# Altium project SmartCoin.PrjPcb
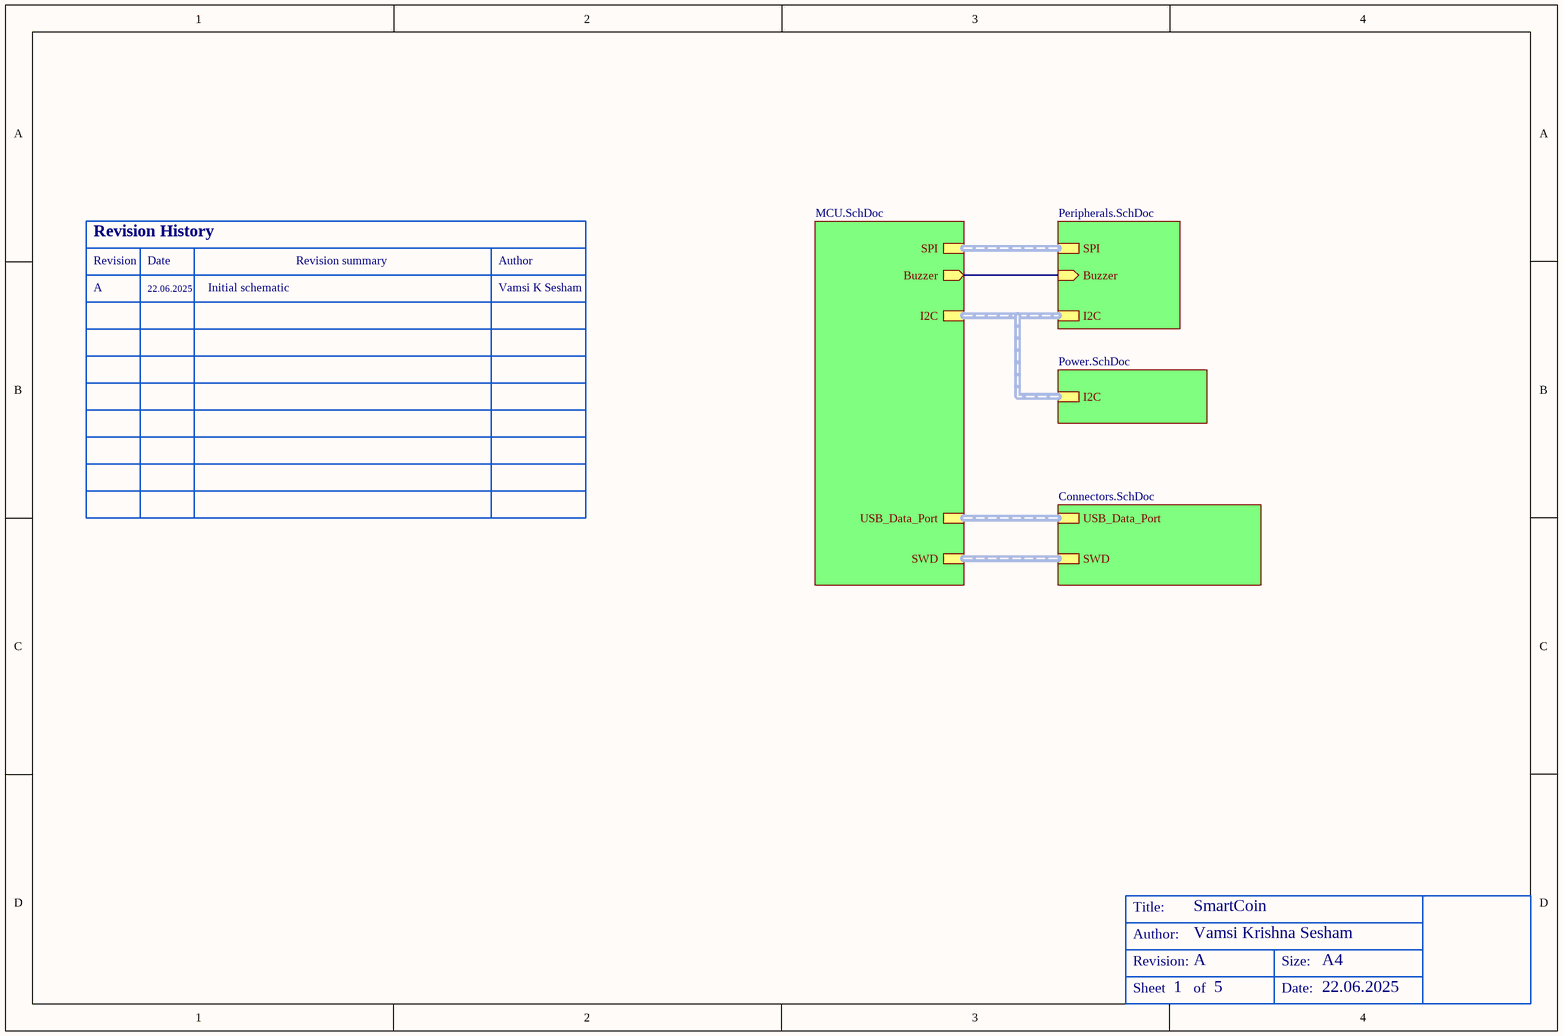
[diagram p0: SmartCoin.SchDoc]
5 sheets, 44 parts. Net scope: hierarchical (ports join the sheet entries above them; power ports are global).
Board file: SmartCoin.PcbDoc
Sheets:
  SmartCoin.SchDoc
     = Peripherals.SchDoc
     = MCU.SchDoc
     = Connectors.SchDoc
     = Power.SchDoc

## Sheet SmartCoin.SchDoc: SmartCoin
size A4; Date: 22.06.2025; Author: Vamsi Krishna Sesham; Revision: A; SheetNumber: 1; SheetTotal: 5

### Parts
(Parts that share a designator on the sheet are numbered #1, #2 ... from top to bottom, then left to right.)
*#1  RevisionHistory  (value not drawn)  (graphical)
*#2  TitleBlock  (value not drawn)  (graphical)

### Sub-sheets
? = Peripherals.SchDoc: I2C (harness I2C), Buzzer (in), SPI (harness SPI_Flash)
? = MCU.SchDoc: USB_Data_Port (harness USB_Data), I2C (harness I2C), SWD (harness SWD Debug), Buzzer (out), SPI (harness SPI_Flash)
? = Connectors.SchDoc: USB_Data_Port (harness USB_Data), SWD (harness SWD Debug)
? = Power.SchDoc: I2C (harness I2C)

### Nets
BZR: sheet /Buzzer, sheet /Buzzer

### Notes on the sheet
- A
- 22.06.2025
- Initial schematic
- Vamsi K Sesham
- (in symbol RevisionHistory) Revision History; Revision; Date; Revision summary; Author
- (in symbol TitleBlock) Title:; Author:; Revision:; Size:; A4; Sheet; of; Date:

## Sheet Peripherals.SchDoc: SmartCoin
size A4; Date: 22.06.2025; Author: Vamsi Krishna Sesham; Revision: A; SheetNumber: 4; SheetTotal: 5
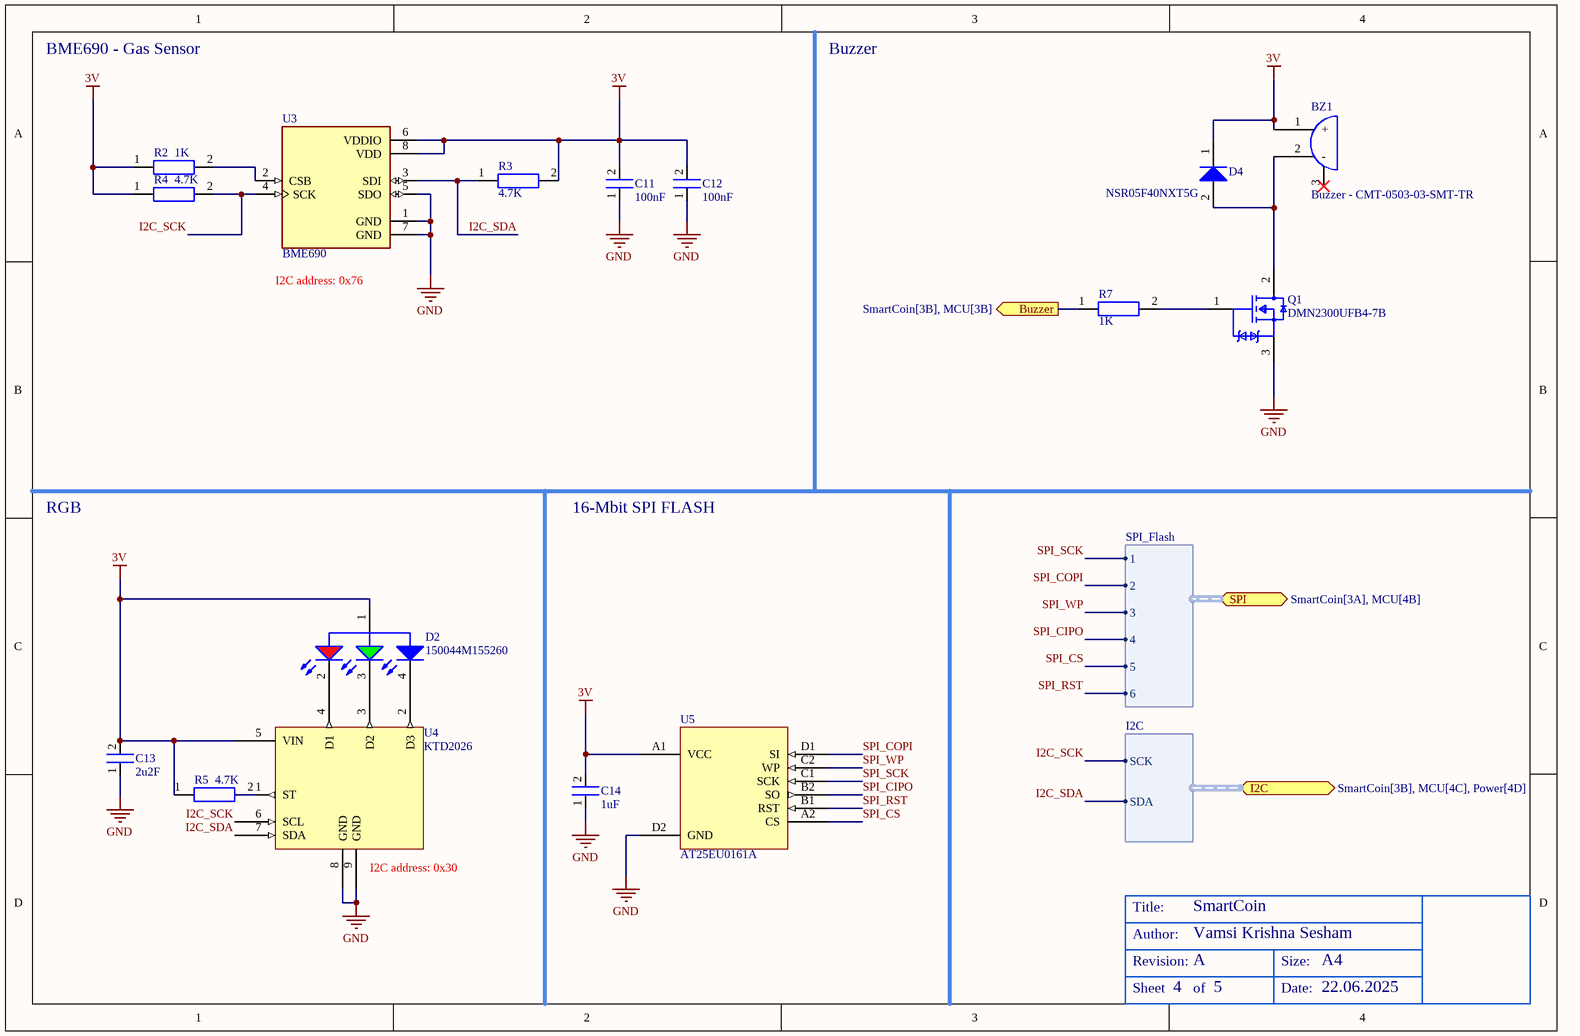
[diagram p1: Peripherals.SchDoc]

### Parts
(Parts that share a designator on the sheet are numbered #1, #2 ... from top to bottom, then left to right.)
*#3  TitleBlock  (value not drawn)  (graphical)
BZ1  Buzzer - CMT-0503-03-SMT-TR  [Buzzer - CMT-0503-03-SMT-TR]
C11  100nF  [Capacitor - 0201]
C12  100nF  [Capacitor - 0201]
C13  2u2F  [Capacitor - 0201]
C14  1uF  [Capacitor - 0201]
D2  150044M155260  [WL-SFCC_0404_150044M155260]
D4  NSR05F40NXT5G  [ONSC-DSN-2-152AC-01_V]
Q1  DMN2300UFB4-7B  [FP-X2-DFN1006-3-MFG]
R2  1K  [Resistor - 0201]
R3  4.7K  [Resistor - 0201]
R4  4.7K  [Resistor - 0201]
R5  4.7K  [Resistor - 0201]
R7  1K  [Resistor - 0201]
U3  BME690  [IC_BME688]
U4  KTD2026  [KTD2026]
U5  AT25EU0161A  [AT25EU0161A]

### Ports
Buzzer (out, see SmartCoin[3B], MCU[3B]), I2C (bidir, harness I2C, see SmartCoin[3B], MCU[4C], Power[4D]), SPI (bidir, harness SPI_Flash, see SmartCoin[3A], MCU[4B])

### Harnesses
I2C: SCK, SDA
SPI_Flash: 1, 2, 3, 4, 5, 6

### Nets
3V: BZ1.1(+) C11.2 C12.2 C13.2 C14.2 D2.1(A) D4.1(K) R2.1 R3.2 R4.1 R5.1 U3.6(VDDIO) U3.8(VDD) U4.5(VIN) U5.A1(VCC)
GND: C11.1 C12.1 C13.1 C14.1 Q1.3(S) U3.1(GND) U3.5(SDO) U3.7(GND) U4.8(GND) U4.9(GND) U5.D2(GND)
BZR: R7.1 ; port Buzzer
I2C_SCK: R4.2 U3.4(SCK) U4.6(SCL) ; port I2C.SCK
I2C_SDA: R3.1 U3.3(SDI) U4.7(SDA) ; port I2C.SDA
SPI_CIPO: U5.B2(SO) ; port SPI.4
SPI_COPI: U5.D1(SI) ; port SPI.2
SPI_CS: U5.A2(CS) ; port SPI.5
SPI_RST: U5.B1(RST) ; port SPI.6
SPI_SCK: U5.C1(SCK) ; port SPI.1
SPI_WP: U5.C2(WP) ; port SPI.3
NetBZ1_2: BZ1.2(-) D4.2(A) Q1.2(D)
NetD2_2: D2.2(K) U4.4(D1)
NetD2_3: D2.3(K) U4.3(D2)
NetD2_4: D2.4(K) U4.2(D3)
NetQ1_1: Q1.1(G) R7.2
NetR2_2: R2.2 U3.2(CSB)
NetR5_2: R5.2 U4.1(ST)

Not connected (* = marked no-connect by the designer): BZ1 3*

### Notes on the sheet
- BME690 - Gas Sensor
- Buzzer
- (near U3) I2C address: 0x76
- RGB
- 16-Mbit SPI FLASH
- (near U4) I2C address: 0x30
- (in symbol TitleBlock) Title:; Author:; Revision:; Size:; A4; Sheet; of; Date:

### Library data of the parts
BZ1 = Buzzer - CMT-0503-03-SMT-TR: MAGNETIC BUZZER TRANSDUCER
C11-C14 = Capacitor - 0201
D2 = CMP-03913-98750578-1: 150044M155260 WL-SFCC SMT Full-color Chip LED compact; Color: Blue, Green, Red; Power Dissipation: 24mW; Reverse Voltage: 5V; Dominant Wavelength: 530nm; Forward Voltage: 2V; Luminous Intensity: 50mcd; Forward Current: 30mA; Peak Wavelength: 465nm; Viewing Angle: 140°; NexarPartId: 98750578; Max Operating Temperature: 85°C; Width: 1mm; Case/Package: 0404; Min Operating Temperature: -40°C; Max Reverse Voltage (DC): 5V; RoHS: Compliant; Length: 1mm; Height: 650µm
D4 = CMP-1055-00232-1: Schottky Barrier Diode, 2-Pin DSN, Pb-Free, Tape and Reel; Manufacturer: On Semiconductor; IFSM Max (A): 10; Configuration: Single; RoHS: TRUE; PackageVersion: Rev. C, 01/2011; ComponentLink3Description: Package Specification; ComponentLink3URL: http://www.onsemi.cn/pub_link/Collateral/152AC.PDF; PackageDescription: 2-Pin Micro Molded Package, Body 1 x 0.6 mm; ComponentLink1URL: http://www.onsemi.com/; ComponentLink1Description: Manufacturer URL; Mounting Technology: Surface Mount; Packing: Tape and Reel; PackageReference: DSN-2-152AC-01; ComponentLink2Description: Datasheet; DatasheetVersion: Rev. 3; ComponentLink2URL: http://www.onsemi.cn/pub_link/Collateral/NSR05F40.PDF; PartNumber: NSR05F40NXT5G
Q1 = CMP-12801-000056-1: MOSFET N-CH 20V 1.3A 3DFN; Manufacturer: Diodes Inc.; Rthja Max: 250°C/W; Standoff Height: 0mm; Turn On Delay Time: 3.5ns; Depletion Mode: False; Number Of N Channels: 1; Max Junction Temp: +150°C; Threshold Vgs Max: 0.95V; Gate To Source Voltage: 8V; Input Capacitace At Vds: 67.6pF @ 20V; Power Dissipation: 500mW; Max Forward Diode Voltage: 1.2V; Pulse Drain Current: 6A; Gate Charge At Vgs: 1.6nC @ 4.5V; Threshold Vgs Min: 0.45V; Drain To Source Resistance: 175mΩ; Turn Off Delay Time: 38ns; Typ Forward Diode Voltage: 0.7V; Category: Trans; Lead Free: Yes; Octopart: https://octopart.com/dmn2300ufb4-7b-diodes+inc.-21789371; RoHS: TRUE; Drain To Source Breakdown Voltage: 20V; ComponentLink2Description: Datasheet; Drain To Source Voltage: 20V; ComponentLink2URL: https://www.diodes.com/assets/Datasheets/DMN2300UFB4.pdf; Automotive: No; Height: 0.4mm; Temperature Range High: +150°C; Package: X2-DFN1006-3; Mouser Description: MOSFET 20V N-Ch ENH Mode 175mOhm 4.5V 1.30A; Digikey Description: MOSFET N-CH 20V 1.3A 3DFN; Footprint Url: https://www.diodes.com/assets/Package-Files/X2-DFN1006-3.pdf; Device Class L1: Discrete Semiconductors; Temperature Range Low: -55°C; Number Of Channels: 1; Device Class L3: MOSFETs; Device Class L2: Transistors; Manufacturer Part Number: DMN2300UFB4-7B; Temperature: -55°C to +150°C; Continuous Drain Current: 1.3A
R2-R5 R7 = Resistor - 0201
U3 = CMP-008-000000-2: Gas sensor measuring relative humidity, barometric pressure, ambient temperature and gas (VOC); Pin Count: 8; Availability: Unavailable; Package: None; Price: None; MP: BME688; Source: BME688.SchLib; Design Item ID: BME688; Value: *; Component Type: Standard; ComponentLink1Description: New link; ComponentLink1URL: https://www.mouser.de/ProductDetail/Bosch-Sensortec/BME690?qs=%252BXxaIXUDbq38jwlEAGDF7A%3D%3D&mgh=1&vip=1&utm_id=20979042634&utm_source=google&utm_medium=cpc&utm_marketing_tactic=emeacorp&gad_source=1&gbraid=0AAAAADn_wf2GV-P32WQOtb6QF-9Q6urY0&gclid=CjwKCAjwn6LABhBSEiwAsNJrjqYGezIL6UTP-OEPoU9ondhUKEEh1LMLQiGljPd-_uXlPKwCiylmnRoC0IEQAvD_BwE
U4 = KTD2026: 3-CHANNEL Rgb Led Driver With I2C
U5 = AT25EU0161A: 16-Mbit, Ultra-Low Energy Serial Flash Memory

## Sheet MCU.SchDoc: SmartCoin
size A4; Date: 22.06.2025; Author: Vamsi Krishna Sesham; Revision: A; SheetNumber: 2; SheetTotal: 5
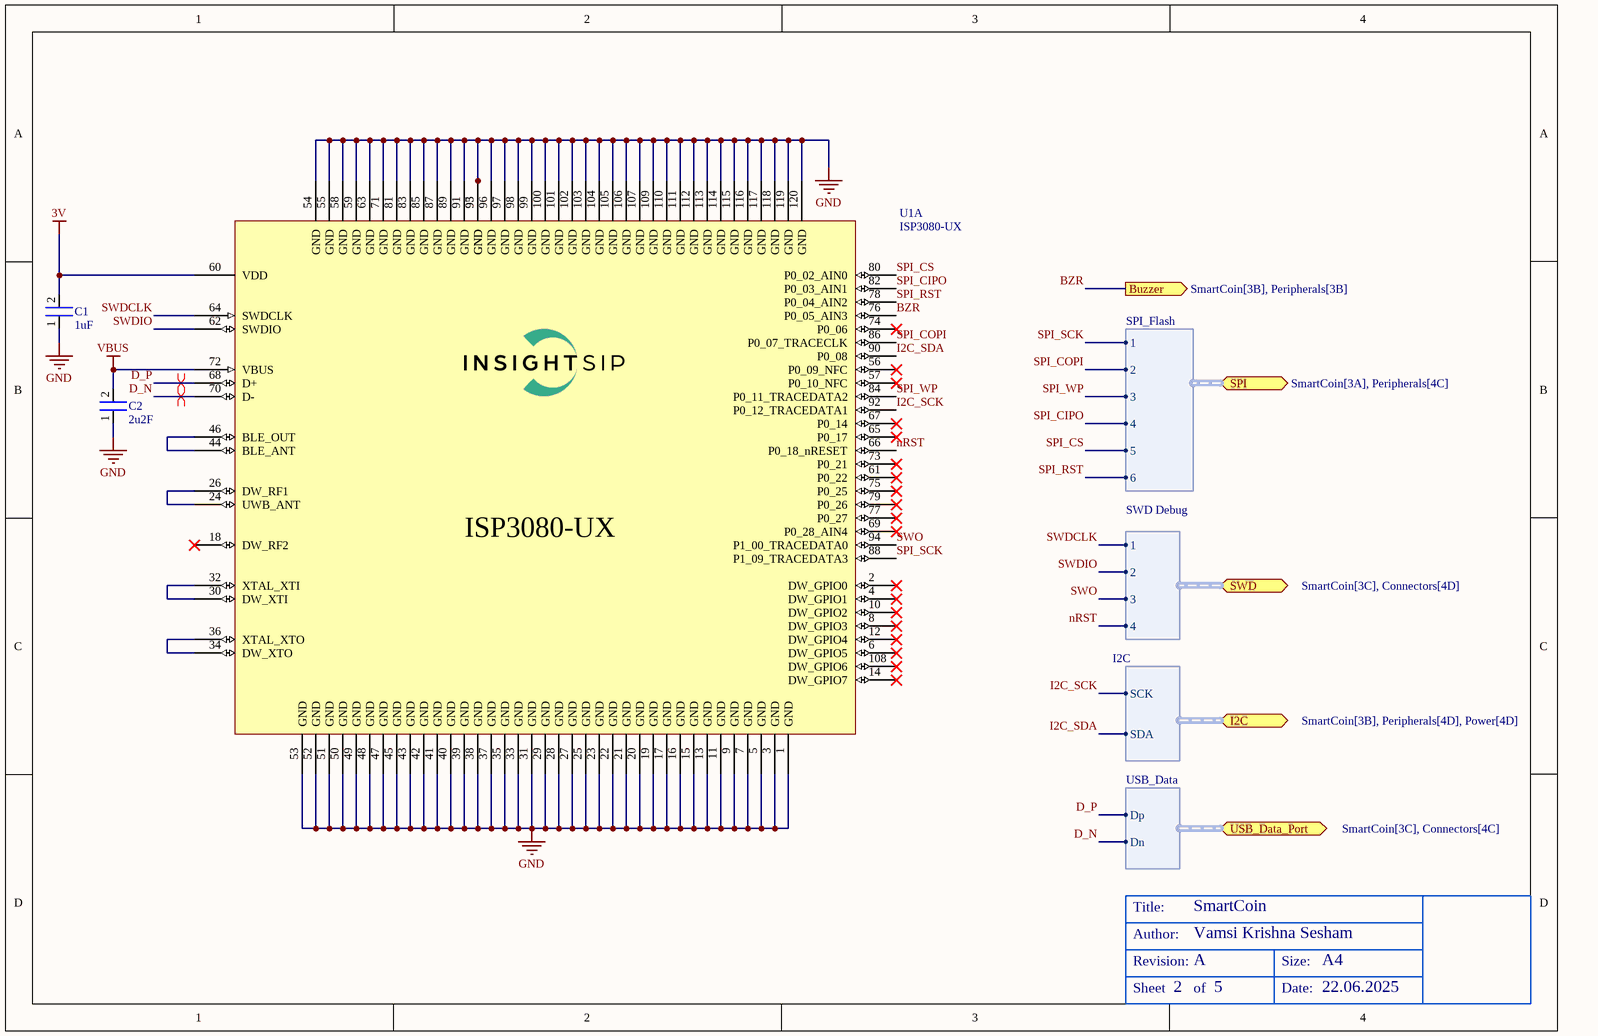
[diagram p2: MCU.SchDoc]

### Parts
(Parts that share a designator on the sheet are numbered #1, #2 ... from top to bottom, then left to right.)
*#4  TitleBlock  (value not drawn)  (graphical)
C1  1uF  [Capacitor - 0201]
C2  2u2F  [Capacitor - 0201]
U1  ISP3080-UX  [ISP3080-UX]  (part A of 2)

### Ports
Buzzer (out, see SmartCoin[3B], Peripherals[3B]), I2C (bidir, harness I2C, see SmartCoin[3B], Peripherals[4D], Power[4D]), SPI (bidir, harness SPI_Flash, see SmartCoin[3A], Peripherals[4C]), SWD (bidir, harness SWD Debug, see SmartCoin[3C], Connectors[4D]), USB_Data_Port (bidir, harness USB_Data, see SmartCoin[3C], Connectors[4C])

### Harnesses
USB_Data: Dp, Dn
I2C: SCK, SDA
SWD Debug: 1, 2, 3, 4
SPI_Flash: 1, 2, 3, 4, 5, 6

### Nets
3V: C1.2 U1.60(VDD)
GND: C1.1 C2.1 U1.1(GND) U1.3(GND) U1.5(GND) U1.7(GND) U1.9(GND) U1.11(GND) U1.13(GND) U1.15(GND) U1.16(GND) U1.17(GND) U1.19(GND) U1.20(GND) U1.21(GND) U1.22(GND) U1.23(GND) U1.25(GND) U1.27(GND) U1.28(GND) U1.29(GND) U1.31(GND) U1.33(GND) U1.35(GND) U1.37(GND) U1.38(GND) U1.39(GND) U1.40(GND) U1.41(GND) U1.42(GND) U1.43(GND) U1.45(GND) U1.47(GND) U1.48(GND) U1.49(GND) U1.50(GND) U1.51(GND) U1.52(GND) U1.53(GND) U1.54(GND) U1.55(GND) U1.58(GND) U1.59(GND) U1.63(GND) U1.71(GND) U1.81(GND) U1.83(GND) U1.85(GND) U1.87(GND) U1.89(GND) U1.91(GND) U1.93(GND) U1.95(GND) U1.96(GND) U1.97(GND) U1.98(GND) U1.99(GND) U1.100(GND) U1.101(GND) U1.102(GND) U1.103(GND) U1.104(GND) U1.105(GND) U1.106(GND) U1.107(GND) U1.109(GND) U1.110(GND) U1.111(GND) U1.112(GND) U1.113(GND) U1.114(GND) U1.115(GND) U1.116(GND) U1.117(GND) U1.118(GND) U1.119(GND) U1.120(GND)
VBUS: C2.2 U1.72(VBUS)
BZR: U1.76(P0_05_AIN3) ; port Buzzer
D_N: U1.70(D-) ; port USB_Data_Port.Dn
D_P: U1.68(D+) ; port USB_Data_Port.Dp
I2C_SCK: U1.92(P0_12_TRACEDATA1) ; port I2C.SCK
I2C_SDA: U1.90(P0_08) ; port I2C.SDA
nRST: U1.66(P0_18_nRESET) ; port SWD.4
SPI_CIPO: U1.82(P0_03_AIN1) ; port SPI.4
SPI_COPI: U1.86(P0_07_TRACECLK) ; port SPI.2
SPI_CS: U1.80(P0_02_AIN0) ; port SPI.5
SPI_RST: U1.78(P0_04_AIN2) ; port SPI.6
SPI_SCK: U1.88(P1_09_TRACEDATA3) ; port SPI.1
SPI_WP: U1.84(P0_11_TRACEDATA2) ; port SPI.3
SWDCLK: U1.64(SWDCLK) ; port SWD.1
SWDIO: U1.62(SWDIO) ; port SWD.2
SWO: U1.94(P1_00_TRACEDATA0) ; port SWD.3
NetU1_24: U1.24(UWB_ANT) U1.26(DW_RF1)
NetU1_30: U1.30(DW_XTI) U1.32(XTAL_XTI)
NetU1_34: U1.34(DW_XTO) U1.36(XTAL_XTO)
NetU1_44: U1.44(BLE_ANT) U1.46(BLE_OUT)

Not connected (* = marked no-connect by the designer): U1 2(DW_GPIO0)* 4(DW_GPIO1)* 6(DW_GPIO5)* 8(DW_GPIO3)* 10(DW_GPIO2)* 12(DW_GPIO4)* 14(DW_GPIO7)* 18(DW_RF2)* 56(P0_09_NFC)* 57(P0_10_NFC)* 61(P0_22)* 65(P0_17)* 67(P0_14)* 69(P0_28_AIN4)* 73(P0_21)* 74(P0_06)* 75(P0_25)* 77(P0_27)* 79(P0_26)* 108(DW_GPIO6)*

### Layout directives
differential pair: D_N, D_P

### Notes on the sheet
- (in symbol TitleBlock) Title:; Author:; Revision:; Size:; A4; Sheet; of; Date:

### Library data of the parts
C1 C2 = Capacitor - 0201
U1 = CMP-006-000000-2: BLE & UWB module (Revision C); Source: ISP3080C.SchLib; Design Item ID: ISP3080-UX

## Sheet Connectors.SchDoc: SmartCoin
size A4; Date: 22.06.2025; Author: Vamsi Krishna Sesham; Revision: A; SheetNumber: 3; SheetTotal: 5
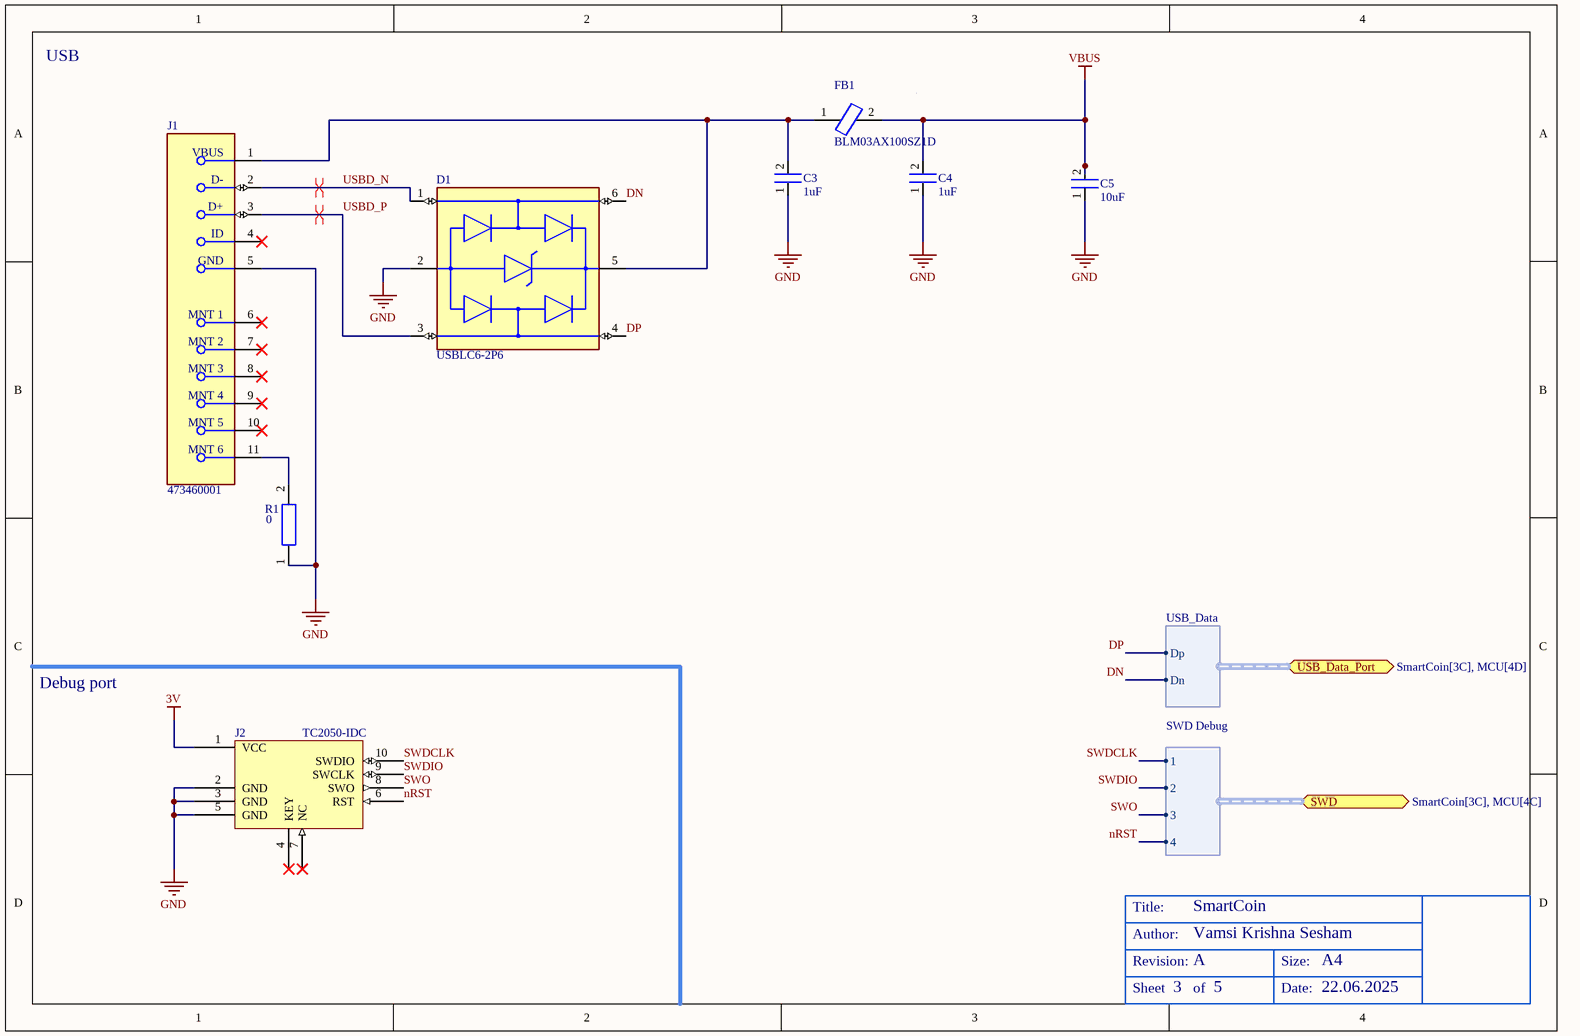
[diagram p3: Connectors.SchDoc]

### Parts
(Parts that share a designator on the sheet are numbered #1, #2 ... from top to bottom, then left to right.)
*#5  TitleBlock  (value not drawn)  (graphical)
C3  1uF  [Capacitor - 0201]
C4  1uF  [Capacitor - 0201]
C5  10uF  [Capacitor - 0402]
D1  USBLC6-2P6  [FP-SOT-666-MFG]
FB1  BLM03AX100SZ1D  [Ferrite Beat - 0201]
J1  473460001  [FP-473460001-MFG]
J2  TC2050-IDC  [TC2050-IDC]  (no BOM)
R1  0  [Resistor - 0402]

### Ports
SWD (bidir, harness SWD Debug, see SmartCoin[3C], MCU[4C]), USB_Data_Port (bidir, harness USB_Data, see SmartCoin[3C], MCU[4D])

### Harnesses
USB_Data: Dp, Dn
SWD Debug: 1, 2, 3, 4

### Nets
3V: J2.1(VCC)
GND: C3.1 C4.1 C5.1 D1.2(GND) J1.5(GND) J2.2(GND) J2.3(GND) J2.5(GND) R1.1
VBUS: C4.2 C5.2 FB1.2
DN: D1.6(I/O1) ; port USB_Data_Port.Dn  [project net D_N]
DP: D1.4(I/O2) ; port USB_Data_Port.Dp  [project net D_P]
nRST: J2.6(RST) ; port SWD.4
SWDCLK: J2.10(SWDIO) ; port SWD.1
SWDIO: J2.9(SWCLK) ; port SWD.2
SWO: J2.8(SWO) ; port SWD.3
USBD_N: D1.1(I/O1) J1.2(D-)
USBD_P: D1.3(I/O2) J1.3(D+)
NetC3_2: C3.2 D1.5(VBUS) FB1.1 J1.1(VBUS)
NetJ1_11: J1.11(MNT_6) R1.2

Not connected (* = marked no-connect by the designer): J1 4(ID)* 6(MNT_1)* 7(MNT_2)* 8(MNT_3)* 9(MNT_4)* 10(MNT_5)*; J2 4(KEY)* 7(NC)*

### Layout directives
differential pair: USBD_N, USBD_P

### Notes on the sheet
- USB
- Debug port
- (in symbol TitleBlock) Title:; Author:; Revision:; Size:; A4; Sheet; of; Date:

### Library data of the parts
C3 C4 = Capacitor - 0201
C5 = Capacitor - 0402
D1 = CMP-12225-000058-1: TVS DIODE 5.25V 17V SOT666; Min Breakdown Voltage: 6V; Power Line Protection: Yes; Element Configuration: Dual; Test Current: 1mA; Working Voltage: 5V; Number of Channels: 2; Max Reverse Leakage Current: 150nA; Direction: Unidirectional; Peak Pulse Current: 5A; Number of Elements: 1; Capacitance: 3.5pF; Max Breakdown Voltage: 6V; Height: 0.6mm; Depth: 1.3mm; Contact Plating: Tin; Reverse Breakdown Voltage: 6V; REACH SVHC: No SVHC; Operating Supply Voltage: 5V; Width: 1.3mm; Max Operating Temperature: 125°C; Reverse Standoff Voltage: 5V; ESD Protection: Yes; Package Quantity: 1; Termination: SMD/SMT; Length: 1.7mm; Leakage Current: 150nA; Number of Bidirectional Channels: 2; Case/Package: SOT-666; Min Operating Temperature: -40°C; Number of Pins: 6; Clamping Voltage: 17V; Breakdown Voltage: 6V; Lead Free: Lead Free; Radiation Hardening: No; Packaging: Tape and Reel; Mount: Surface Mount; Polarity: Unidirectional
FB1 = Ferrite Bead - 0201: Supplier 1: Digikey; Supplier Part Number 1: 445-MPZ1608S601ATD25CT-ND
J1 = CMP-2000-05246-2: CONN RCPT USB2.0 MICRO B SMD R/A; Manufacturer: Molex; Conn Orientation: Right Angle; Is Female: yes; Shielding: true; Pitch: 0.65mm; Number Of Contacts: 5; Voltage Rating: 30V; Current Rating: 1.8A; Device Class L2: USB Connectors; Digikey Description: CONN RCPT USB2.0 MICRO B SMD R/A; Height: 2.945mm; RoHS: TRUE; ComponentLink2Description: Datasheet; Octopart: https://octopart.com/47346-0001-molex-7164928; Automotive: No; Package: 0; Category: Conn; Device Class L1: Connectors; Usb Standard: USB 2.0; Temperature: -30°C to +85°C; Temperature Range Low: -30°C; Footprint Url: https://www.molex.com/pdm_docs/sd/473460001_sd.pdf; ComponentLink2URL: https://www.molex.com/webdocs/datasheets/pdf/en-us/0473460001_IO_CONNECTORS.pdf; Lead Free: Yes; Manufacturer Part Number: 473460001; Contact Material: Gold,Nickel; Temperature Range High: +85°C; Device Class L3: unset
R1 = Resistor - 0402

## Sheet Power.SchDoc: SmartCoin
size A4; Date: 22.06.2025; Author: Vamsi Krishna Sesham; Revision: A; SheetNumber: 5; SheetTotal: 5
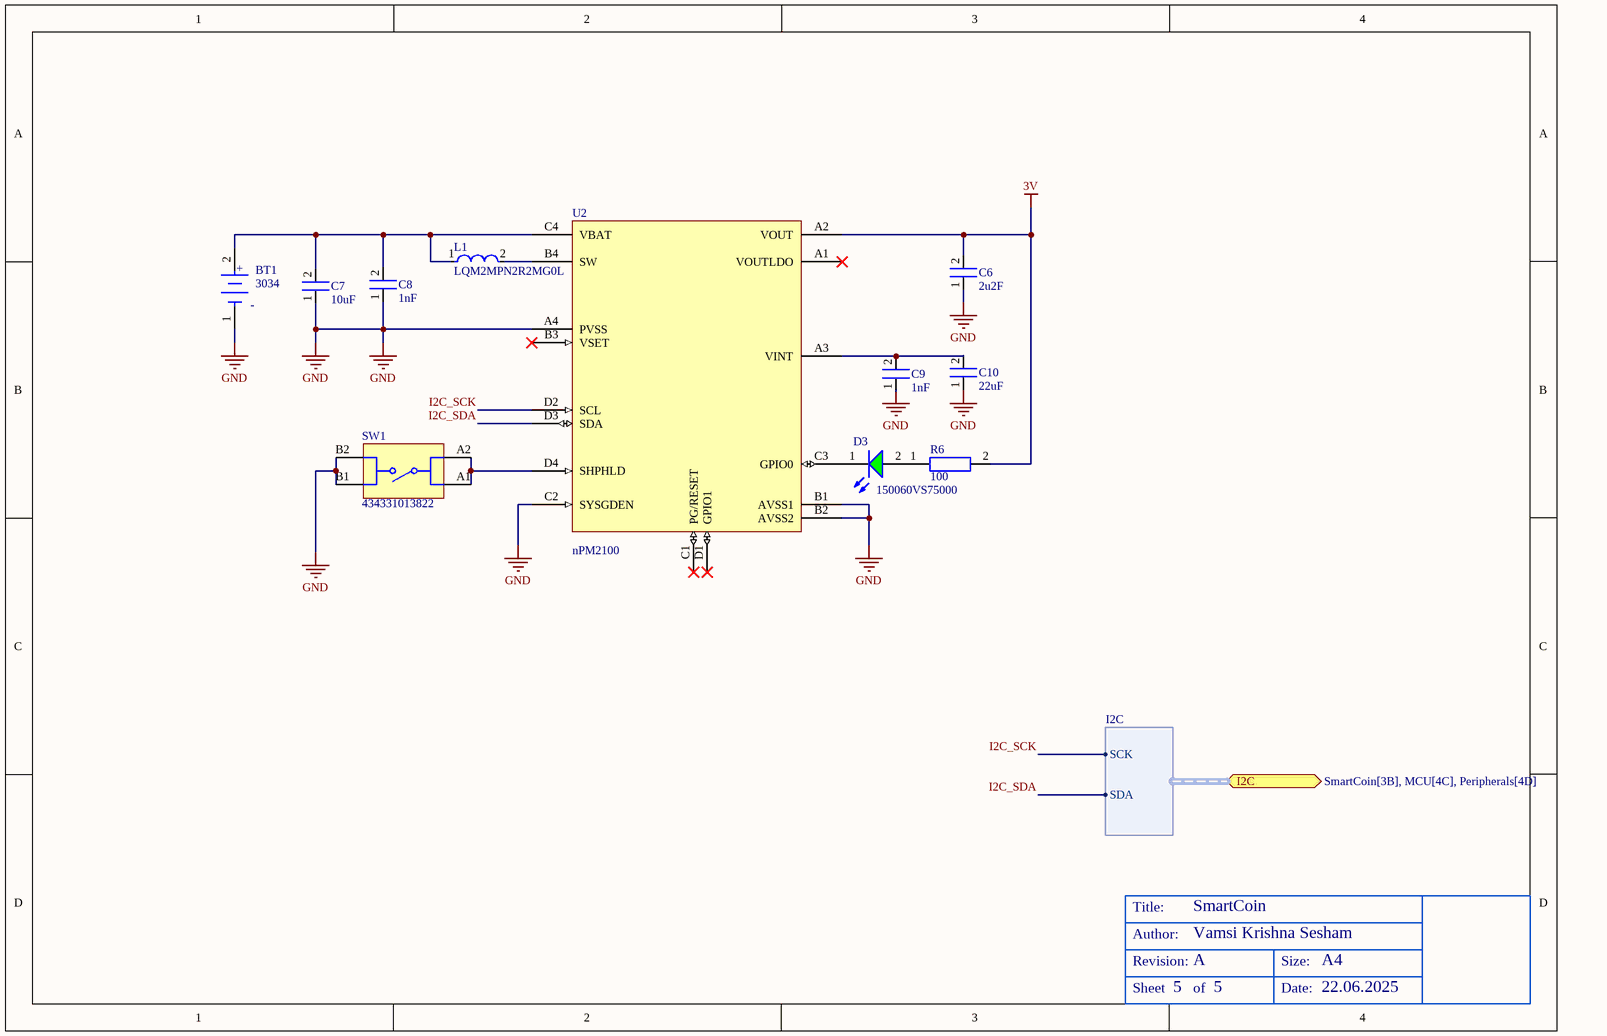
[diagram p4: Power.SchDoc]

### Parts
(Parts that share a designator on the sheet are numbered #1, #2 ... from top to bottom, then left to right.)
*#6  TitleBlock  (value not drawn)  (graphical)
BT1  3034  [FP-3034-MFG]
C6  2u2F  [Capacitor - 0201]
C7  10uF  [Capacitor - 0402]
C8  1nF  [Capacitor - 0201]
C9  1nF  [Capacitor - 0201]
C10  22uF  [Capacitor - 0402]
D3  150060VS75000  [WL-SMCW_0603_150060xx75000]
L1  LQM2MPN2R2MG0L  [FP-LQM2MPN_G0-IPC_A]
R6  100  [Resistor - 0201]
SW1  434331013822  [434331013822]
U2  nPM2100  [npm2100]

### Ports
I2C (bidir, harness I2C, see SmartCoin[3B], MCU[4C], Peripherals[4D])

### Harnesses
I2C: SCK, SDA

### Nets
3V: C6.2 R6.2 U2.A2(VOUT)
GND: BT1.1(C) C6.1 C7.1 C8.1 C9.1 C10.1 SW1.B1 SW1.B2 U2.A4(PVSS) U2.B1(AVSS1) U2.B2(AVSS2) U2.C2(SYSGDEN)
I2C_SCK: U2.D2(SCL) ; port I2C.SCK
I2C_SDA: U2.D3(SDA) ; port I2C.SDA
NetBT1_2: BT1.2(A) C7.2 C8.2 L1.1 U2.C4(VBAT)
NetC9_2: C9.2 C10.2 U2.A3(VINT)
NetD3_1: D3.1(K) U2.C3(GPIO0)
NetD3_2: D3.2(A) R6.1
NetL1_2: L1.2 U2.B4(SW)
NetSW1_A1: SW1.A1 SW1.A2 U2.D4(SHPHLD)

Not connected (* = marked no-connect by the designer): U2 A1(VOUTLDO)* B3(VSET)* C1(PG/RESET)* D1(GPIO1)*

### Notes on the sheet
- (in symbol CMP-19636-000006-1) +; -
- (in symbol TitleBlock) Title:; Author:; Revision:; Size:; A4; Sheet; of; Date:

### Library data of the parts
BT1 = CMP-19636-000006-1: BATTERY RETAINER COIN 20MM SMD; Manufacturer: Keystone Electronics; Number Of Contacts: 2; Height: 4.31mm; Device Class L1: Connectors; Device Class L3: unset; RoHS: TRUE; Automotive: No; Mouser Description: Coin Cell Battery Holders COIN CELL RETAINER; Contact Material: Nickel; Digikey Description: BATTERY RETAINER COIN 20MM SMD; Category: Batt; Package: 3034; ComponentLink2URL: https://www.keyelco.com/product-pdf.cfm?p=798; Manufacturer Part Number: 3034; Octopart: https://octopart.com/3034-keystone-27554462; ComponentLink2Description: Datasheet; Device Class L2: unset; Lead Free: Yes
C6 C8 C9 = Capacitor - 0201
C7 C10 = Capacitor - 0402
D3 = CMP-1426-00006-7: WURTH ELEKTRONIK - 150060VS75000 - LED, Green, SMD, 0603, 30 mA, 2 V, 570 nm; Reverse Voltage: 5V; Power Dissipation: 72mW; Dominant Wavelength: 570nm; Peak Wavelength: 572nm; Forward Current: 100mA; Forward Voltage: 2V; Lens Style: Clear, Rectangular; Test Current: 20mA; Max Junction Temperature (Tj): 95°C; Viewing Angle: 140°; Luminous Intensity: 40mcd; Height: 700µm; Width: 800µm; Length: 1.6mm; Mount: Surface Mount; Min Operating Temperature: -40°C; Max Reverse Voltage (DC): 5V; Case Code (Imperial): 0603; Wavelength: 570nm; Color: Green; REACH SVHC: Unknown; RoHS: Compliant; Max Operating Temperature: 85°C; Packaging: Tape and Reel; Case/Package: 0603; Number of Pins: 2; Case Code (Metric): 1608
L1 = CMP-06042-008995-1: Multilayer Type Inductor for Power Lines, 0806 (2016), 2.2μH, 20%, 0.138Ω, 1.2A; DC Resistance (DCR): 138mR; Inductance: 2.2uH; Self Resonant Frequency: 40MHz; Core Material: Ferrite; Shielding: Shielded; Test Frequency: 1MHz; Weight: 0.000353oz; Termination: SMD/SMT; Case Code (Metric): 2012; Height - Seated (Max): 0.039inch; Max Operating Temperature: 125°C; Length: 0.079inch; Max DC Current: 1.2A; Package Quantity: 3000; Width: 0.049inch; Min Operating Temperature: -55°C; Packaging: Tape and Reel; Height: 0.9mm; Tolerance: 20%; Mount: Surface Mount; Case/Package: 0805; Current Rating: 1.2A; Case Code (Imperial): 0805
R6 = Resistor - 0201
SW1 = CMP-03913-71472419-1: 434331013822 Tactile Switch, 0.05A, 12Vdc, 220Gf, Smd Rohs Compliant: Yes; Illumination Type: Non-Illuminated; Voltage Rating: 12V; Mechanical Life: 100kcycles; Throw Configuration: SPST; Actuator Material: Nylon, Polyamide; Switch Travel: 200µm; Switch Function: Off-Mom; Current Rating: 50mA; Insulation Resistance: 100MΩ; Height: 1.35mm; RoHS: Compliant; Termination: SMD/SMT; Mount: Surface Mount; NexarPartId: 71472419; Contact Material: Steel; Min Operating Temperature: -40°C; Packaging: Tape and Reel; Contact Plating: Silver; Max Operating Temperature: 85°C

## Nets that join several sheets
3V: Peripherals (15 pins), MCU (C1.2 U1.60), Connectors (J2.1), Power (C6.2 R6.2 U2.A2)
GND: Peripherals (11 pins), MCU (77 pins), Connectors (9 pins), Power (12 pins)
VBUS: MCU (C2.2 U1.72), Connectors (C4.2 C5.2 FB1.2)
BZR: Peripherals (R7.1), MCU (U1.76)
D_N: MCU (U1.70), Connectors (D1.6)
D_P: MCU (U1.68), Connectors (D1.4)
I2C_SCK: Peripherals (R4.2 U3.4 U4.6), MCU (U1.92), Power (U2.D2)
I2C_SDA: Peripherals (R3.1 U3.3 U4.7), MCU (U1.90), Power (U2.D3)
nRST: MCU (U1.66), Connectors (J2.6)
SPI_CIPO: Peripherals (U5.B2), MCU (U1.82)
SPI_COPI: Peripherals (U5.D1), MCU (U1.86)
SPI_CS: Peripherals (U5.A2), MCU (U1.80)
SPI_RST: Peripherals (U5.B1), MCU (U1.78)
SPI_SCK: Peripherals (U5.C1), MCU (U1.88)
SPI_WP: Peripherals (U5.C2), MCU (U1.84)
SWDCLK: MCU (U1.64), Connectors (J2.10)
SWDIO: MCU (U1.62), Connectors (J2.9)
SWO: MCU (U1.94), Connectors (J2.8)